# Altium schematic sheet OVP_OCP.SchDoc
size A4
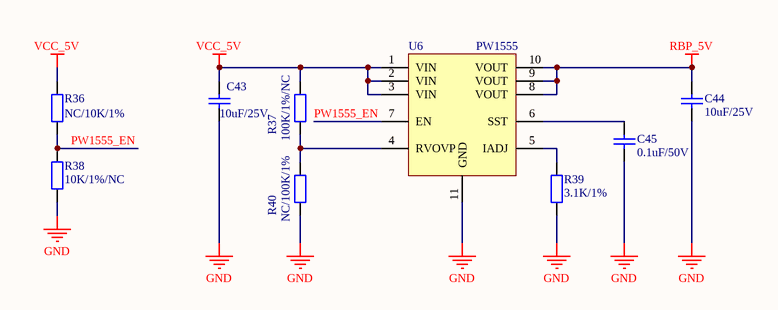
[diagram p0: OVP_OCP.SchDoc]

## Parts
C43  10uF/25V  [C0805_L]
C44  10uF/25V  [C0805_L]
C45  0.1uF/50V  [C0402_L]
R36  NC/10K/1%  [R0402_L]
R37  100K/1%/NC  [R0402_L]
R38  10K/1%/NC  [R0402_L]
R39  3.1K/1%  [R0402_L]
R40  NC/100K/1%  [R0402_L]
U6  PW1555  [DFN3x3-10]

## Nets
GND: C43.1 C44.1 C45.1 R38.1 R39.1 R40.1 U6.11(GND)
RBP_5V: C44.2 U6.8(VOUT) U6.9(VOUT) U6.10(VOUT)
VCC_5V: C43.2 R36.2 R37.2 U6.1(VIN) U6.2(VIN) U6.3(VIN)
PW1555_EN: R36.1 R38.2 U6.7(EN)
NetC45_2: C45.2 U6.6(SST)
NetR37_1: R37.1 R40.2 U6.4(RVOVP)
NetR39_2: R39.2 U6.5(IADJ)

## Library data of the parts
C43-C45 = C: 贴片电容; BOM名称: 无极性贴片电容; 联系卖家，免费查找封装: 唯一出售店铺网址https://shop463601444.taobao.com
R36-R40 = R: 贴片电阻; 联系卖家，免费查找封装: 唯一出售店铺网址https://shop463601444.taobao.com; BOM名称: 贴片电阻
U6 = PW1555: VOVP  ILIM保护芯片